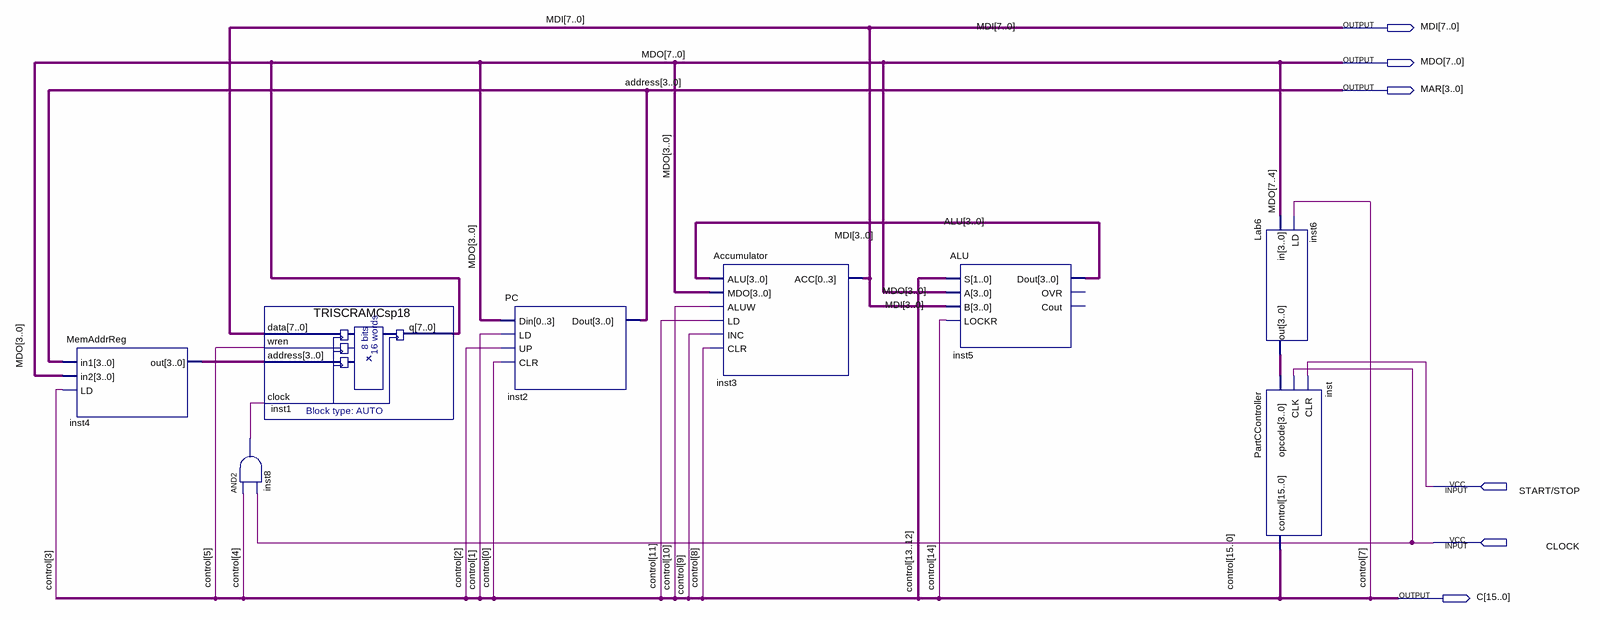
[diagram p0: schematic sheet]
// Quartus schematic PartC.bdf as structural Verilog: 8 symbols, 6 pins
module PartC (
  input  \START/STOP ,
  input  CLOCK,
  output [7:0] MDI,
  output [7:0] MDO,
  output [3:0] MAR,
  output [15:0] C
);

  wire inst8_out;
  wire [3:0] ALU, inst4_out, inst6_out;

  MemAddrReg inst4 (.in1(MAR), .in2(MDO[3:0]), .LD(C[3]), .out(inst4_out));
  TRISCRAMCsp18 inst1 (.data(MDI), .wren(C[5]), .address(inst4_out), .clock(inst8_out), .q(MDO));
  and inst8 (inst8_out, C[4], CLOCK);
  PC inst2 (.Din(MDO[3:0]), .LD(C[1]), .UP(C[2]), .CLR(C[0]), .Dout(MAR));
  Accumulator inst3 (.ALU(ALU), .MDO(MDO[3:0]), .ALUW(C[10]), .LD(C[11]), .INC(C[9]), .CLR(C[8]), .ACC(MDI[3:0]));
  ALU inst5 (.S(C[13:12]), .A(MDO[3:0]), .B(MDI[3:0]), .LOCKR(C[14]), .Dout(ALU));  // open: OVR, Cout
  Lab6 inst6 (.in(MDO[7:4]), .LD(C[7]), .out(inst6_out));
  PartCController inst (.opcode(inst6_out), .CLK(CLOCK), .CLR(\START/STOP ), .control(C));

  // Other names for the same wires on the sheet: address[3:0] = MAR; control[15:0] = C
endmodule
